# EAGLE design SynkinoLC_RevB (EAGLE 9.6.2)
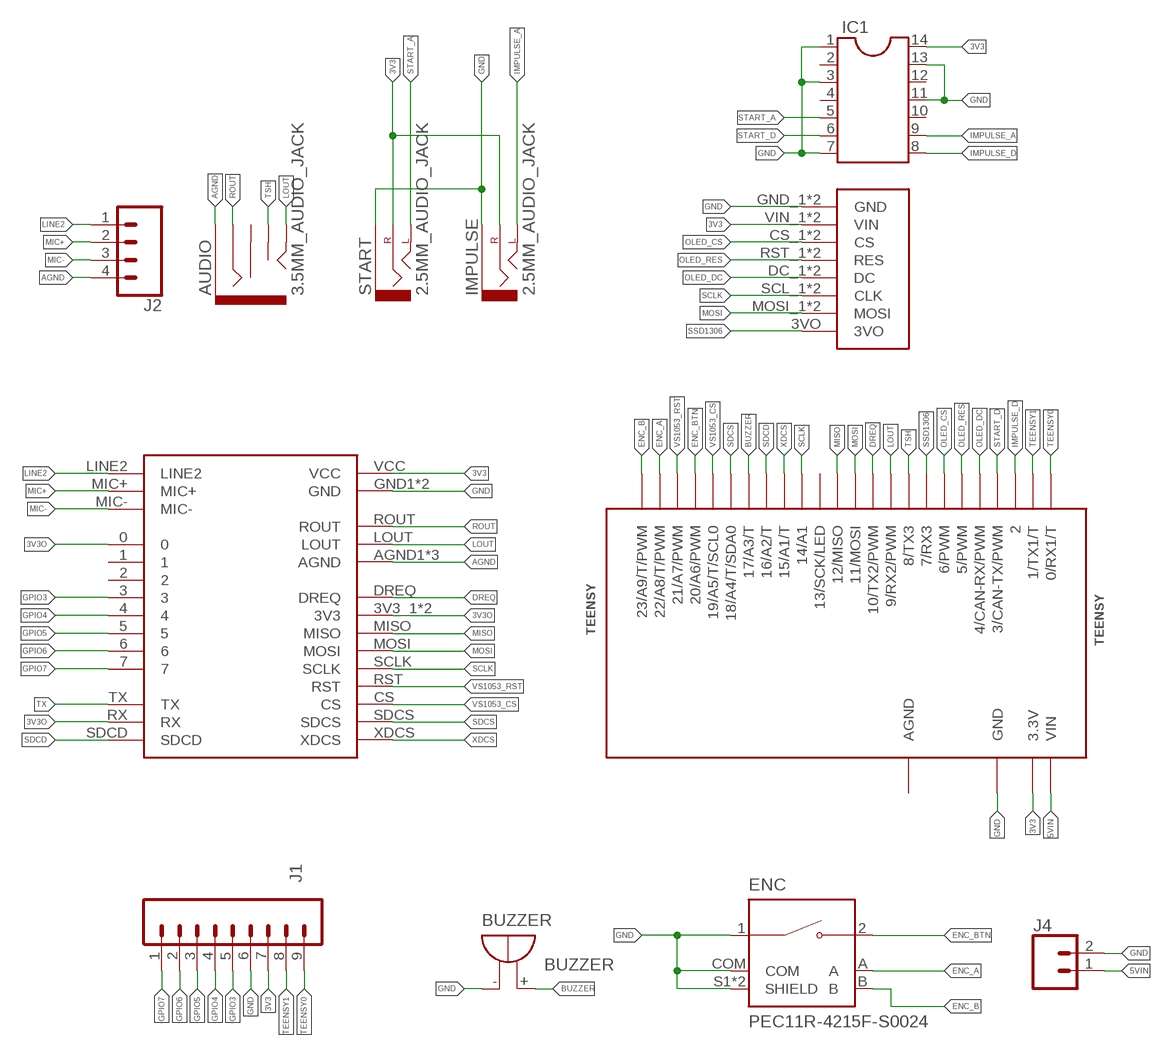
[diagram p0: schematic, sheet 1]

## Parts
AUDIO  3.5MM_AUDIO_JACK  [3.5MM_AUDIO_JACK]
BUZZER  BUZZER  [BUZZER]
DISPLAY  SPI_DISPLAYSPI_DISPLAY2  [SPI_DISPLAY2]
ENC  PEC11R-4215F-S0024  [XDCR_PEC11R-4215F-S0024]
IC1  DIL14R  [DIL14_ROUND]
IMPULSE  2.5MM_AUDIO_JACK  [2.5MM_AUDIO_JACK]
J1  CONN_09NO_SILK  [1X09_NO_SILK]
J2  CONN_04  [1X04]
J4  CONN_021X02_NO_SILK  [1X02_NO_SILK]
START  2.5MM_AUDIO_JACK  [2.5MM_AUDIO_JACK]
TEENSY  TEENSY  [TEENSY]
U$2  VS1053B  [VS1053B]

## Nets
3V3: DISPLAY.VIN_1(VIN) DISPLAY.VIN_2(VIN) IC1.14 IMPULSE.RING(RIGHT) J1.7 START.RING(RIGHT) TEENSY.3.3V U$2.VCC
3V3O: U$2.0 U$2.3V3_1(3V3) U$2.3V3_2(3V3) U$2.RX
5VIN: J4.1 TEENSY.VIN
AGND: AUDIO.SLEEVE J2.4 U$2.AGND1(AGND) U$2.AGND2(AGND) U$2.AGND3(AGND)
BUZZER: BUZZER.+(-) TEENSY.17/A3(17/A3/T)
DREQ: TEENSY.10(10/TX2/PWM) U$2.DREQ
ENC_A: ENC.A TEENSY.22/A8(22/A8/T/PWM)
ENC_B: ENC.B TEENSY.23/A9(23/A9/T/PWM)
ENC_BTN: ENC.2 TEENSY.20/A6(20/A6/PWM)
GND: BUZZER.-(+) DISPLAY.GND_1(GND) DISPLAY.GND_2(GND) ENC.1 ENC.COM ENC.S1(SHIELD) ENC.S2(SHIELD) IC1.1 IC1.3 IC1.7 IC1.11 IC1.13 IMPULSE.SLEEVE J1.6 J4.2 START.SLEEVE TEENSY.GND U$2.GND1(GND) U$2.GND2(GND)
GPIO3: J1.5 U$2.3
GPIO4: J1.4 U$2.4
GPIO5: J1.3 U$2.5
GPIO6: J1.2 U$2.6
GPIO7: J1.1 U$2.7
IMPULSE_A: IC1.9 IMPULSE.TIP_1(LEFT) IMPULSE.TIP_2(LEFT)
IMPULSE_D: IC1.8 TEENSY.2
LINE2: J2.1 U$2.LINE2
LOUT: AUDIO.TIP TEENSY.9(9/RX2/PWM) U$2.LOUT
MIC+: J2.2 U$2.MIC+
MIC-: J2.3 U$2.MIC-
MISO: TEENSY.12(12/MISO) U$2.MISO
MOSI: DISPLAY.MOSI_1(MOSI) DISPLAY.MOSI_2(MOSI) TEENSY.11(11/MOSI) U$2.MOSI
OLED_CS: DISPLAY.CS_1(CS) DISPLAY.CS_2(CS) TEENSY.6(6/PWM)
OLED_DC: DISPLAY.DC_1(DC) DISPLAY.DC_2(DC) TEENSY.4(4/CAN-RX/PWM)
OLED_RES: DISPLAY.RST_1(RES) DISPLAY.RST_2(RES) TEENSY.5(5/PWM)
ROUT: AUDIO.RING U$2.ROUT
SCLK: DISPLAY.SCL_1(CLK) DISPLAY.SCL_2(CLK) TEENSY.14/A0(14/A1) U$2.SCLK
SDCD: TEENSY.16/A2(16/A2/T) U$2.SDCD
SDCS: TEENSY.18/A4(18/A4/T/SDA0) U$2.SDCS
SSD1306: DISPLAY.3VO TEENSY.7(7/RX3)
START_A: IC1.5 START.TIP_1(LEFT) START.TIP_2(LEFT)
START_D: IC1.6 TEENSY.3(3/CAN-TX/PWM)
TEENSY0: J1.9 TEENSY.0(0/RX1/T)
TEENSY1: J1.8 TEENSY.1(1/TX1/T)
TSH: AUDIO.TSH TEENSY.8(8/TX3)
TX: U$2.TX
VS1053_CS: TEENSY.19/A5(19/A5/T/SCL0) U$2.CS
VS1053_RST: TEENSY.21/A7(21/A7/PWM) U$2.RST
XDCS: TEENSY.15/A1(15/A1/T) U$2.XDCS
Unconnected: AUDIO.RSH IC1.2 IC1.4 IC1.10 IC1.12 TEENSY.13(13/SCK/LED) U$2.1 U$2.2

## Power pins joined to a net without a drawn wire
AGND: TEENSY.AGND

## Library data of the parts
AUDIO = synkino:3.5MM_AUDIO_JACK
BUZZER = synkino:BUZZER: BUZZER Source: Buerklin; OC_FARNELL: unknown; OC_NEWARK: unknown
DISPLAY = synkino:SPI_DISPLAY
ENC = PEC11R-4215F-S0024:PEC11R-4215F-S0024: Incremental Encoder, 12 Mm, Contact Rating 10 Ma - 5 Vdc Check availability <https://pricing.snapeda.com/parts/PEC11R-4215F-S0024/Bourns/view-part?ref=eda>; AVAILABILITY: In Stock; DESCRIPTION: Rotary Encoder Mechanical 24 Quadrature (Incremental) Vertical; MF: Bourns; MP: PEC11R-4215F-S0024; PACKAGE: None; PRICE: None; PURCHASE-URL: https://pricing.snapeda.com/search/part/PEC11R-4215F-S0024/?ref=eda
IC1 = synkino:DIL14: Dual In Line / Socket
IMPULSE START = synkino:2.5MM_AUDIO_JACK
J1 = SparkFun-Connectors:CONN_09: Multi connection point. Often used as Generic Header-pin footprint for 0.1 inch spaced/style header connections On any of the 0.1 inch spaced packages, you can populate with these: Break Away Headers - Straight <https://www.sparkfun.com/products/116> (PRT-00116) Break Away Male Headers - Right Angle <https://www.sparkfun.com/products/553> (PRT-00553) Female Headers <https://www.sparkfun.com/products/115> (PRT-00115) Break Away Headers - Machine Pin <https://www.sparkfun.com/products/117> (PRT-00117) Break Away Female Headers - Swiss Machine Pin <https://www.sparkfun.com/products/743> (PRT-00743) For SCREWTERMINALS and SPRING TERMINALS visit here: Screw Terimnals on SparkFun.com <https://www.sparkfun.com/search/results?term=Screw+Terminals> (5mm/3.5mm/2.54mm spacing) This device is also useful as a general connection point to wire up your design to another part of your project. Our various solder wires solder well into these plated through hole pads. Hook-Up Wire - Assortment (Stranded, 22 AWG) <https://www.sparkfun.com/products/11375> (PRT-11375) Hook-Up Wire - Assortment (Solid Core, 22 AWG) <https://www.sparkfun.com/products/11367> (PRT-11367) View the entire wire category on our website here <https://www.sparkfun.com/categories/141> Special notes: Molex polarized connector foot print use with SKU : PRT-08231 with associated crimp pins and housings. 1MM SMD Version SKU: PRT-10208 NOTES ON THE VARIANTS LOCK and LOCK_LONGPADS... This footprint was designed to help hold the alignment of a through-hole component (i.e. 6-pin header) while soldering it into place. You may notice that each hole has been shifted either up or down by 0.005 of an inch from it's more standard position (which is a perfectly straight line). This slight alteration caused the pins (the squares in the middle) to touch the edges of the holes. Because they are alternating, it causes a "brace" to hold the component in place. 0.005 has proven to be the perfect amount of "off-center" position when using our standard breakaway headers. Although looks a little odd when you look at the bare footprint, once you have a header in there, the alteration is very hard to notice. Also,if you push a header all the way into place, it is covered up entirely on the bottom side.
J2 = synkino:CONN_04: Multi connection point. Often used as Generic Header-pin footprint for 0.1 inch spaced/style header connections On any of the 0.1 inch spaced packages, you can populate with these: Break Away Headers - Straight <https://www.sparkfun.com/products/116> (PRT-00116) Break Away Male Headers - Right Angle <https://www.sparkfun.com/products/553> (PRT-00553) Female Headers <https://www.sparkfun.com/products/115> (PRT-00115) Break Away Headers - Machine Pin <https://www.sparkfun.com/products/117> (PRT-00117) Break Away Female Headers - Swiss Machine Pin <https://www.sparkfun.com/products/743> (PRT-00743) For SCREWTERMINALS and SPRING TERMINALS visit here: Screw Terimnals on SparkFun.com <https://www.sparkfun.com/search/results?term=Screw+Terminals> (5mm/3.5mm/2.54mm spacing) This device is also useful as a general connection point to wire up your design to another part of your project. Our various solder wires solder well into these plated through hole pads. Hook-Up Wire - Assortment (Stranded, 22 AWG) <https://www.sparkfun.com/products/11375> (PRT-11375) Hook-Up Wire - Assortment (Solid Core, 22 AWG) <https://www.sparkfun.com/products/11367> (PRT-11367) View the entire wire category on our website here <https://www.sparkfun.com/categories/141> Special notes: Molex polarized connector foot print use with SKU : PRT-08231 with associated crimp pins and housings. 1MM SMD Version SKU: PRT-10208; PROD_ID: CONN-09696
J4 = SparkFun-Connectors:CONN_02: Multi connection point. Often used as Generic Header-pin footprint for 0.1 inch spaced/style header connections On any of the 0.1 inch spaced packages, you can populate with these: Break Away Headers - Straight <https://www.sparkfun.com/products/116> (PRT-00116) Break Away Male Headers - Right Angle <https://www.sparkfun.com/products/553> (PRT-00553) Female Headers <https://www.sparkfun.com/products/115> (PRT-00115) Break Away Headers - Machine Pin <https://www.sparkfun.com/products/117> (PRT-00117) Break Away Female Headers - Swiss Machine Pin <https://www.sparkfun.com/products/743> (PRT-00743) For SCREWTERMINALS and SPRING TERMINALS visit here: Screw Terimnals on SparkFun.com <https://www.sparkfun.com/search/results?term=Screw+Terminals> (5mm/3.5mm/2.54mm spacing) This device is also useful as a general connection point to wire up your design to another part of your project. Our various solder wires solder well into these plated through hole pads. Hook-Up Wire - Assortment (Stranded, 22 AWG) <https://www.sparkfun.com/products/11375> (PRT-11375) Hook-Up Wire - Assortment (Solid Core, 22 AWG) <https://www.sparkfun.com/products/11367> (PRT-11367) View the entire wire category on our website here <https://www.sparkfun.com/categories/141> Special notes: Molex polarized connector foot print use with: PRT-08233 with associated crimp pins and housings. 2.54_SCREWTERM for use with PRT-10571. 3.5mm Screw Terminal footprints for PRT-08084 5mm Screw Terminal footprints for use with PRT-08432
TEENSY = synkino:TEENSY
U$2 = synkino:VS1053B

## Board
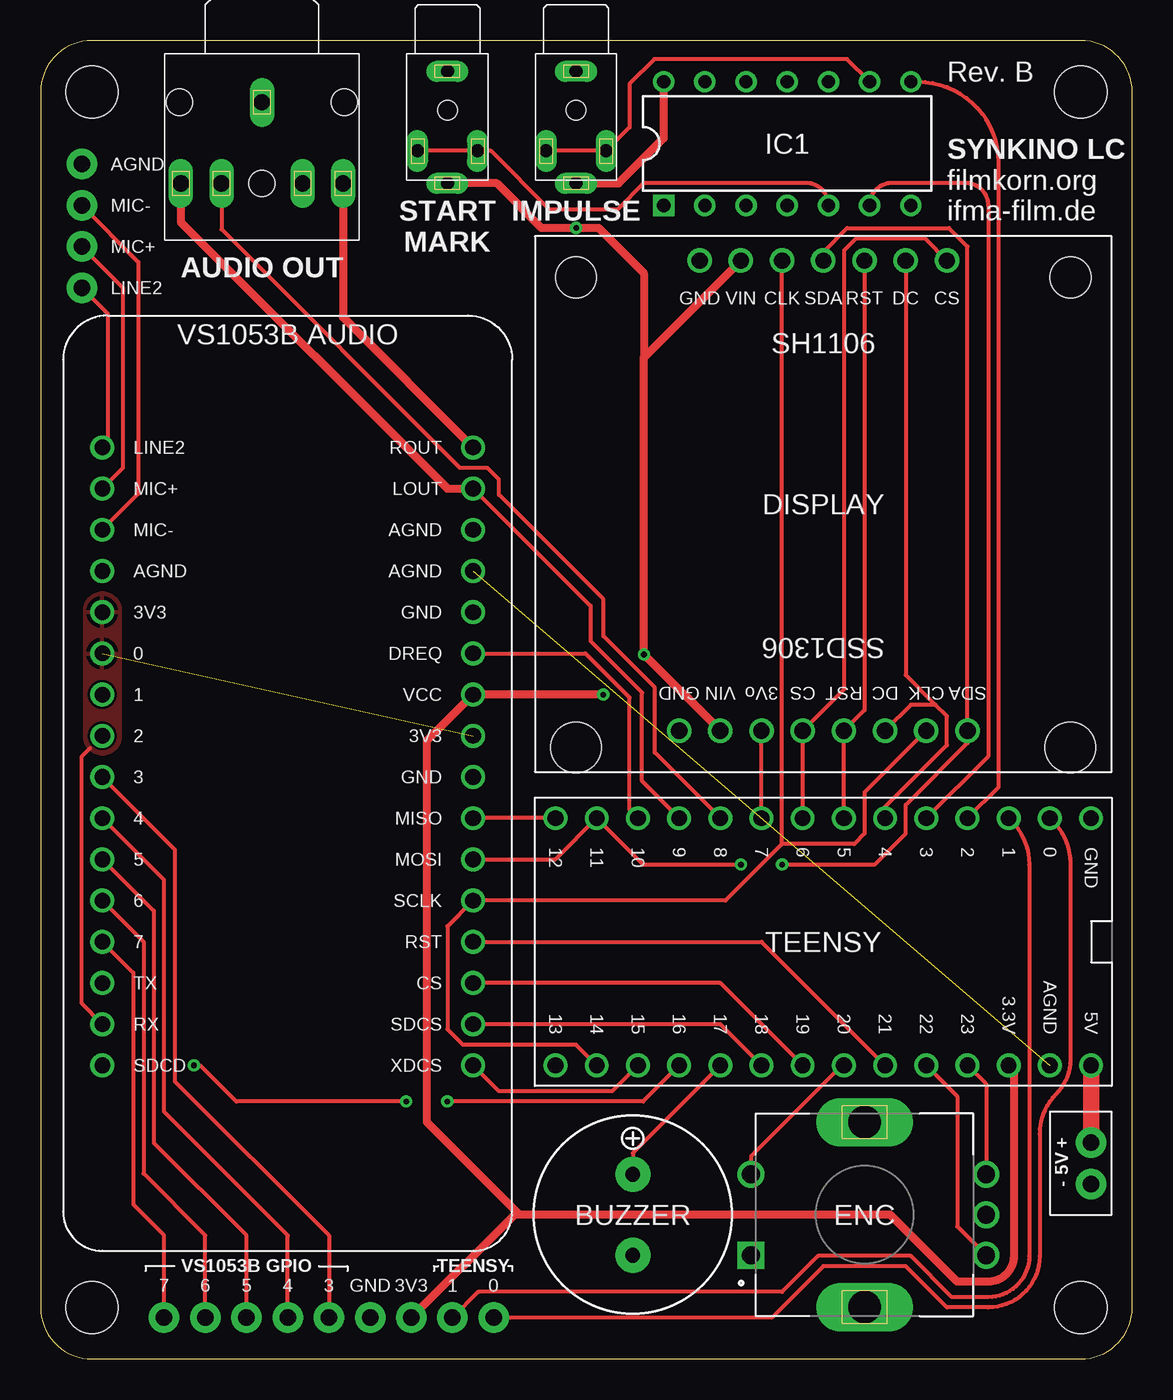
[diagram p1: board, top side]
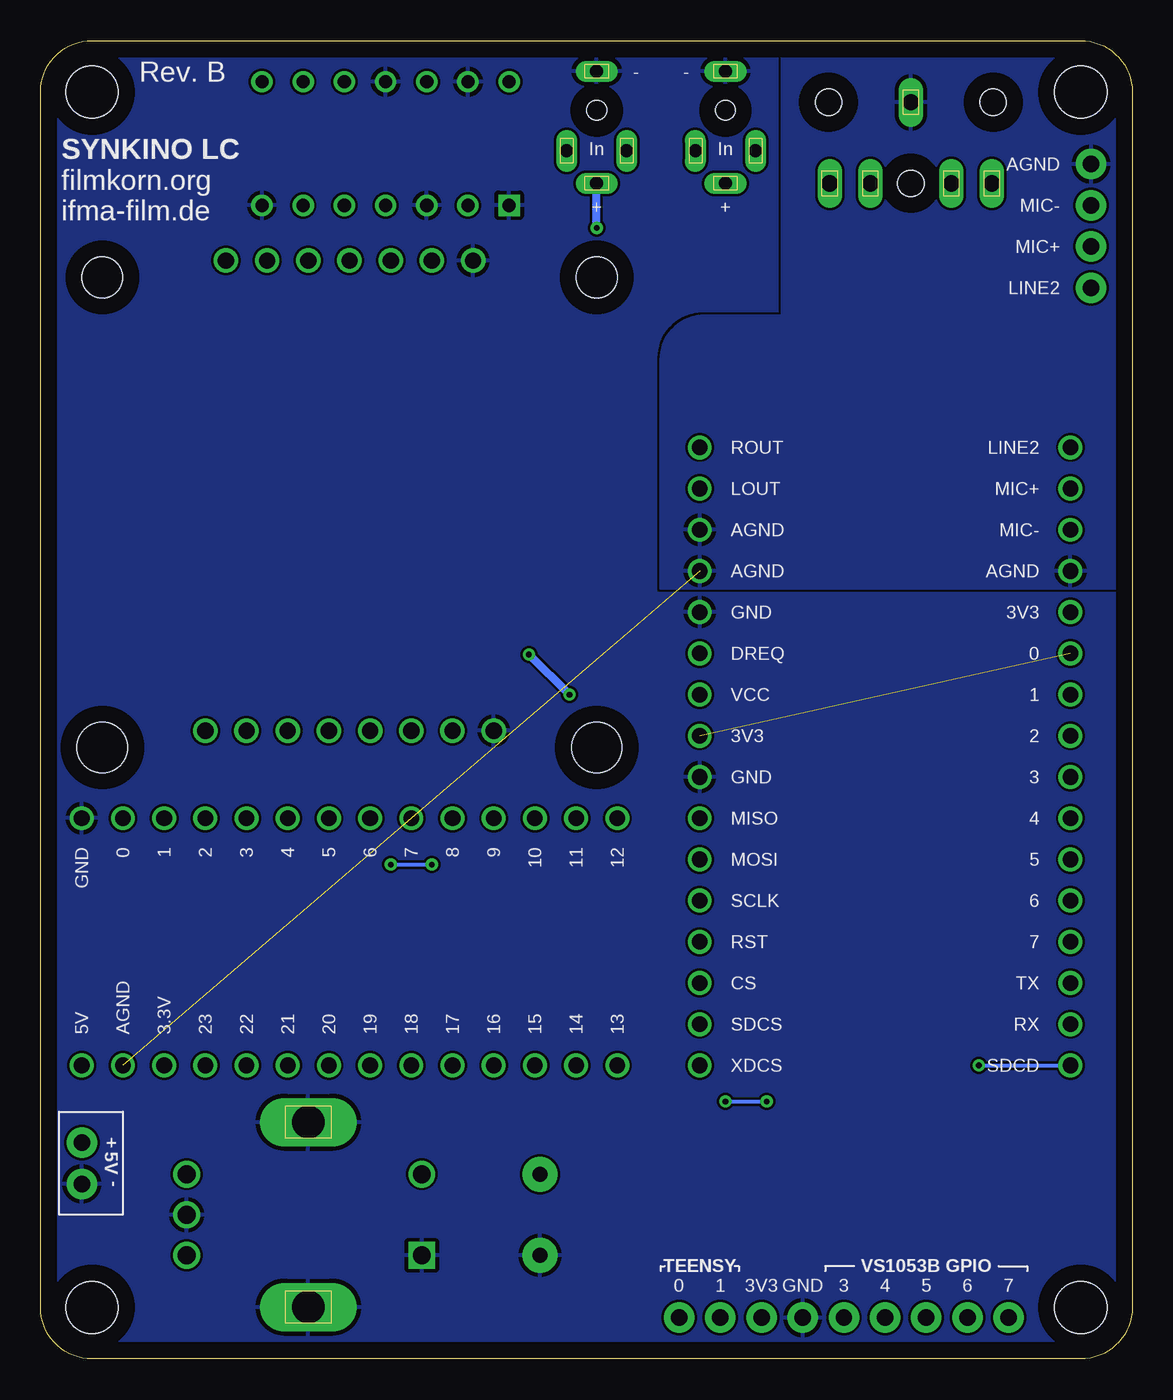
[diagram p2: board, bottom side, seen from below]

Size 67.31 x 81.28 mm. Coordinates in mm from the lower left corner, seen from the top.
Outline: 0,78.11 0,3.17 arc90 3.17,0 64.14,0 arc90 67.31,3.17 67.31,78.11 arc90 64.14,81.28 3.17,81.28 arc90 0,78.11
Copper layers (1*16): Top 0.035mm / dielectric 1.5mm / Bottom 0.035mm
Design rules "default": minimum track width 6mil, minimum drill 0.35mm, track to track 6mil, track to pad 6mil, pad to pad 6mil, via to via 6mil, smd to smd 6mil, copper to edge 40mil, drill to drill 6mil, minimum pad ring 10mil, minimum via ring 8mil, stop-mask expansion 4mil, vias tented up to drill 0mil, thermal gap 10mil
Holes 3.2 mm at 3.17,78.11 3.17,3.17 64.14,78.11 64.14,3.17

### Footprints (pad centres in the part's own frame; a part is rotated, then mirrored left to right if it is on the bottom)
3.5MM_AUDIO_JACK = drill 1 long: RING 5,-5; RSH 2.5,-5; SLEEVE 0,0; TIP -5,-5; TSH -2.5,-5 | hole 1.6: 5.08,0; -5.08,0; 0,-5
BUZZER = drill 0.914 pad 2.159: + 2.5,0; - -2.5,0
SPI_DISPLAY2 = drill 1: 3VO 3.81,13.97; CS_1 1.27,13.97; CS_2 -7.62,-15.01; DC_1 -3.81,13.97; DC_2 -5.08,-15.01; GND_1 8.89,13.97; GND_2 7.62,-15.01; MOSI_1 -8.89,13.97; MOSI_2 0,-15.01; RST_1 -1.27,13.97; RST_2 -2.54,-15.01; SCL_1 -6.35,13.97; SCL_2 2.54,-15.01; VIN_1 6.35,13.97; VIN_2 5.08,-15.01 | hole 2.5: 15.24,-13.97; -15.24,-13.97 | hole 3.1: -15.24,15.01; 15.24,15.01
XDCR_PEC11R-4215F-S0024 = drill 1.1 square: 1 -2.5,7 | drill 1.1: 2 2.5,7; A -2.5,-7.5; B 2.5,-7.5; COM 0,-7.5 | drill 2 long: S1 -5.7,0; S2 5.7,0
DIL14_ROUND = drill 0.813 square: 1 -7.62,-3.81 | drill 0.813: 2 -5.08,-3.81; 3 -2.54,-3.81; 4 0,-3.81; 5 2.54,-3.81; 6 5.08,-3.81; 7 7.62,-3.81; 8 7.62,3.81; 9 5.08,3.81; 10 2.54,3.81; 11 0,3.81; 12 -2.54,3.81; 13 -5.08,3.81; 14 -7.62,3.81
2.5MM_AUDIO_JACK = drill 0.8 long: RING 0,-6.9; SLEEVE 0,0; TIP_1 -1.85,-4.9; TIP_2 1.85,-4.9 | hole 1.2: 0,-2.4
1X09_NO_SILK = drill 1.016 pad 1.88: 1 0,0; 2 2.54,0; 3 5.08,0; 4 7.62,0; 5 10.16,0; 6 12.7,0; 7 15.24,0; 8 17.78,0; 9 20.32,0
1X04 = drill 1.016 pad 1.88: 1 0,0; 2 2.54,0; 3 5.08,0; 4 7.62,0
1X02_NO_SILK = drill 1.016 pad 1.88: 1 0,0; 2 2.54,0
TEENSY = drill 0.965: 0 -7.62,13.97; 1 -7.62,11.43; 2 -7.62,8.89; 3 -7.62,6.35; 3.3V 7.62,11.43; 4 -7.62,3.81; 5 -7.62,1.27; 6 -7.62,-1.27; 7 -7.62,-3.81; 8 -7.62,-6.35; 9 -7.62,-8.89; 10 -7.62,-11.43; 11 -7.62,-13.97; 12 -7.62,-16.51; 13 7.62,-16.51; 14/A0 7.62,-13.97; 15/A1 7.62,-11.43; 16/A2 7.62,-8.89; 17/A3 7.62,-6.35; 18/A4 7.62,-3.81; 19/A5 7.62,-1.27; 20/A6 7.62,1.27; 21/A7 7.62,3.81; 22/A8 7.62,6.35; 23/A9 7.62,8.89; AGND 7.62,13.97; GND -7.62,16.51; VIN 7.62,16.51
VS1053B = drill 0.965: 0 -11.43,7.62; 1 -11.43,5.08; 2 -11.43,2.54; 3 -11.43,0; 3V3_1 11.43,2.54; 3V3_2 -11.43,10.16; 4 -11.43,-2.54; 5 -11.43,-5.08; 6 -11.43,-7.62; 7 -11.43,-10.16; AGND1 -11.43,12.7; AGND2 11.43,15.24; AGND3 11.43,12.7; CS 11.43,-12.7; DREQ 11.43,7.62; GND1 11.43,10.16; GND2 11.43,0; LINE2 -11.43,20.32; LOUT 11.43,17.78; MIC+ -11.43,17.78; MIC- -11.43,15.24; MISO 11.43,-2.54; MOSI 11.43,-5.08; ROUT 11.43,20.32; RST 11.43,-10.16; RX -11.43,-15.24; SCLK 11.43,-7.62; SDCD -11.43,-17.78; SDCS 11.43,-15.24; TX -11.43,-12.7; VCC 11.43,5.08; XDCS 11.43,-17.78

### Placement (x,y rotation side)
AUDIO  13.65,77.48 0 top
BUZZER  36.51,8.89 90 top
DISPLAY  48.26,52.7 180 top
ENC  50.8,8.89 90 top
IC1  46.04,74.93 0 top
IMPULSE  33.02,79.38 0 top
J1  7.62,2.54 0 top
J2  2.54,66.04 90 top
J4  64.77,13.34 270 top
START  25.08,79.38 0 top
TEENSY  48.26,25.72 270 top
U$2  15.24,35.88 0 top

### Tracks (layer width: path | path; a pad name or v marks a point on that pad's centre or on a via)
3V3  (via drill 0.35)
  Top 0.508: 29.53,8.89 52.39,8.89 56.52,4.76 58.42,4.76 arc90 60.01,6.35 60.01,17.78 TEENSY.3.3V | 29.53,8.89 29.21,8.89 J1.7 | 29.53,8.89 23.81,14.61 23.81,38.1 U$2.VCC v34.7,40.96 | START.RING 28.13,72.47 30.88,69.72 v33.02,69.72 34.42,69.72 37.2,66.94 37.2,61.73 | IMPULSE.RING 35.65,72.47 38.42,75.25 IC1.14 | DISPLAY.VIN_1 37.22,43.43 v37.2,43.43 37.2,61.73 | DISPLAY.VIN_2 37.2,61.73
  Bottom 0.508: v33.02,69.72 IMPULSE.RING | v37.2,43.43 v37.19,43.43 v34.7,40.96
3V3O  (1 unrouted)
  Top 0.254: U$2.RX 2.54,21.91 2.54,37.15 3.05,37.66
  pour Top: 3.81,47.24 arc-90 4.95,46.1 4.95,38.42 arc-90 3.81,37.27 arc-90 2.69,38.39 2.69,46.13 arc-90
5VIN
  Top 1.016: TEENSY.VIN J4.1
AGND  (1 unrouted)
  pour Bottom: 21.59,81.28 21.59,64.33 26.35,64.33 arc-90 29.08,61.59 29.08,47.5 0,47.5 0,81.28
BUZZER
  Top 0.254: TEENSY.17/A3 36.51,12.7 BUZZER.+
DREQ
  Top 0.254: TEENSY.10 36.32,33.85 36.32,40.77 33.59,43.5 U$2.DREQ
ENC_A
  Top 0.254: ENC.A 56.52,8.18 56.52,16.19 TEENSY.22/A8
ENC_B
  Top 0.254: ENC.B 58.3,16.95 TEENSY.23/A9
ENC_BTN
  Top 0.254: TEENSY.20/A6 49.4,18.1 43.8,12.49 ENC.2
GND
  pour Bottom (rank 2): 0,81.28 67.31,81.28 67.31,0 0,0
GPIO3
  Top 0.254: U$2.3 8.28,31.41 8.28,17.12 17.78,7.62 J1.5
GPIO4
  Top 0.254: U$2.4 7.62,29.53 7.62,15.24 15.24,7.62 J1.4
GPIO5
  Top 0.254: U$2.5 6.99,27.62 6.99,13.34 12.7,7.62 J1.3
GPIO6
  Top 0.254: U$2.6 6.35,25.72 6.35,11.43 10.16,7.62 J1.2
GPIO7
  Top 0.254: U$2.7 5.71,23.81 5.71,9.53 7.62,7.62 J1.1
IMPULSE_A
  Top 0.254: IMPULSE.TIP_1 IMPULSE.TIP_2 36.32,75.93 36.32,78.61 37.85,80.14 49.72,80.14 IC1.9
IMPULSE_D
  Top 0.254: IC1.8 54.08,78.74 arc-90 59.05,73.77 59.05,35.24 TEENSY.2
LINE2
  Top 0.254: J2.1 4.13,64.45 4.13,56.52 U$2.LINE2
LOUT
  Top 0.254: TEENSY.9 37.08,35.62 37.08,41.08 33.91,44.26 33.91,46.42 U$2.LOUT
  Top 0.508: AUDIO.TIP 8.65,70.09 25.08,53.66 U$2.LOUT
MIC+
  Top 0.254: U$2.MIC+ 5.08,54.93 5.08,66.04 J2.2
MIC-
  Top 0.254: U$2.MIC- 6.03,53.34 6.03,67.63 J2.3
MISO
  Top 0.254: TEENSY.12 U$2.MISO
MOSI  (via drill 0.35)
  Top 0.254: U$2.MOSI 31.75,30.8 TEENSY.11 37.15,30.48 v43.18,30.48 | DISPLAY.MOSI_2 48.26,68.24 49.72,69.72 56.01,69.72 57.15,68.58 DISPLAY.MOSI_1 57.15,37.97 53.34,34.16 53.34,32.38 51.44,30.48 v45.72,30.48
  Bottom 0.254: v45.72,30.48 v43.18,30.48
OLED_CS
  Top 0.254: TEENSY.6 DISPLAY.CS_1 49.53,41.27 49.53,68.33 50.29,69.09 54.51,69.09 DISPLAY.CS_2
OLED_DC
  Top 0.254: 55.18,40.32 53.34,42.16 DISPLAY.DC_2 | TEENSY.4 52.07,34.04 55.88,37.85 55.88,39.62 55.18,40.32 | 55.18,40.32 53.66,40.32 DISPLAY.DC_1
OLED_RES
  Top 0.254: DISPLAY.RST_2 50.8,40.01 DISPLAY.RST_1 TEENSY.5
ROUT
  Top 0.508: AUDIO.RING 18.65,64.22 U$2.ROUT
SCLK
  Top 0.254: 45.72,31.75 42.23,28.26 U$2.SCLK 25.08,26.67 25.08,20.32 26.04,19.37 33.02,19.37 TEENSY.14/A0 | 45.72,31.75 DISPLAY.SCL_2 | DISPLAY.SCL_1 50.8,34.92 50.8,32.38 50.16,31.75 45.72,31.75
SDCD  (via drill 0.35)
  Top 0.254: v25.08,15.88 37.15,15.88 TEENSY.16/A2 | v22.54,15.88 12.06,15.88 9.84,18.1 v9.46,18.1
  Bottom 0.254: v25.08,15.88 v22.54,15.88 | v9.46,18.1 U$2.SDCD
SDCS
  Top 0.254: TEENSY.18/A4 41.91,20.64 U$2.SDCS
SSD1306
  Top 0.254: TEENSY.7 DISPLAY.3VO
START_A
  Top 0.254: START.TIP_1 START.TIP_2 27.76,74.47 31.37,70.87 35.56,70.87 37.21,72.52 47.18,72.52 arc-90 IC1.5
START_D
  Top 0.254: IC1.6 arc-90 52.52,72.52 57.02,72.52 arc-90 58.42,71.12 58.42,37.15 TEENSY.3
TEENSY0
  Top 0.254: TEENSY.0 62.38,33.19 arc-45 63.5,30.48 63.5,18.48 arc-45 62.61,16.32 arc45 61.59,13.88 61.59,6.35 arc-90 58.42,3.17 55.88,3.17 53.34,5.71 48.26,5.71 45.09,2.54 J1.9
TEENSY1
  Top 0.254: TEENSY.1 59.84,33.19 arc-45 60.96,30.48 60.96,6.35 arc-90 58.42,3.81 56.2,3.81 53.66,6.35 47.94,6.35 45.72,4.13 26.99,4.13 J1.8
TSH
  Top 0.254: AUDIO.TSH 11.15,69.64 25.87,54.93 27.56,54.93 28.26,54.23 28.26,53.28 34.7,46.84 34.7,44.55 37.87,41.38 37.87,37.38 TEENSY.8
VS1053_CS
  Top 0.254: TEENSY.19/A5 41.91,23.18 U$2.CS
VS1053_RST
  Top 0.254: U$2.RST 44.45,25.72 TEENSY.21/A7
XDCS
  Top 0.254: TEENSY.15/A1 35.24,16.51 28.26,16.51 U$2.XDCS

### Text on the board
tPlace: AGND | MIC- | START / MARK | MIC+ | AUDIO OUT | LINE2 | VS1053B GPIO | TEENSY | 7 | 6 | 5 | 4 | 3 | GND | 3V3 | 1 | 0
bPlace: - | - | Rev. B | In | In | SYNKINO LC | AGND | filmkorn.org / ifma-film.de | MIC- | + | + | MIC+ | LINE2 | VS1053B GPIO | TEENSY | 7 | 6 | 5 | 4 | 3 | GND | 3V3 | 1 | 0
tNames: Rev. B | SYNKINO LC | filmkorn.org / ifma-film.de | + | 5V | -
bNames: + | 5V | -